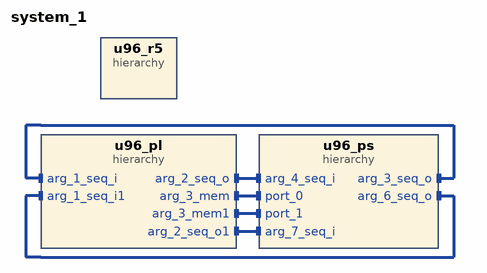
[diagram p0: block diagram of the top level]
# Vivado block design system_1, xczu3eg-sbva484-1-e, Vivado 2019.2
create_bd_design system_1

create_bd_cell -type hier u96_pl
create_bd_cell -type hier u96_ps
create_bd_cell -type hier u96_r5

# ---- hierarchy /u96_pl ----
current_bd_instance /u96_pl
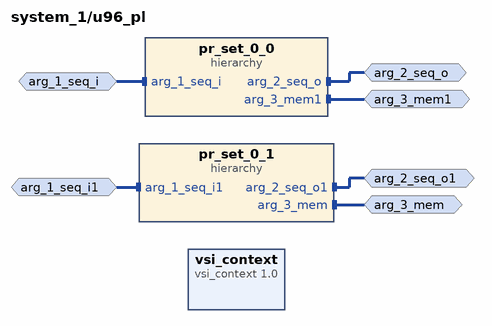
[diagram p1: block diagram inside /u96_pl]
create_bd_intf_pin -mode Master -vlnv xilinx.com:interface:aximm_rtl:1.0 arg_3_mem
create_bd_intf_pin -mode Master -vlnv xilinx.com:interface:aximm_rtl:1.0 arg_3_mem1
create_bd_intf_pin -mode Slave -vlnv xilinx.com:interface:axis_rtl:1.0 arg_1_seq_i
create_bd_intf_pin -mode Slave -vlnv xilinx.com:interface:axis_rtl:1.0 arg_1_seq_i1
create_bd_intf_pin -mode Master -vlnv xilinx.com:interface:axis_rtl:1.0 arg_2_seq_o
create_bd_intf_pin -mode Master -vlnv xilinx.com:interface:axis_rtl:1.0 arg_2_seq_o1

create_bd_cell -type ip -vlnv vsi.com:platform:vsi_context:1.0 vsi_context
set_property -dict [list \
  CONFIG.LOGO_FILE data/vsi_context_hardware_pr.png \
  CONFIG.OS Linux \
  CONFIG.build_output binary \
  CONFIG.c_compiler_options {-std=c11 -static -g -DDEBUG -O0} \
  CONFIG.cc_compiler_options {-std=c++11 -static -g -DDEBUG -O0 -fpermissive} \
  CONFIG.cc_prefix null \
  CONFIG.cpu_type 1 \
  CONFIG.current_platform ultra96_platform \
  CONFIG.default_fifo_size 65536 \
  CONFIG.fpga_board em.avnet.com:ultra96v1:part0:1.2 \
  CONFIG.fpga_part xczu3eg-sbva484-1-e \
  CONFIG.hostname localhost \
  CONFIG.impl_strategy default \
  CONFIG.include_directories {$(XFOPENCV)/include,} \
  CONFIG.ip_build_in false \
  CONFIG.is_cc false \
  CONFIG.is_main true \
  CONFIG.is_system_gui true \
  CONFIG.language hls \
  CONFIG.load_on_demand true \
  CONFIG.map_exposed api \
  CONFIG.map_port 1999 \
  CONFIG.no_dma false \
  CONFIG.num_cpus 1 \
  CONFIG.platform_power 0 \
  CONFIG.python_version 2 \
  CONFIG.reserve_crs 3 \
  CONFIG.rt_build_type 1 \
  CONFIG.simulator 1 \
  CONFIG.synthesis_mode 1 \
  CONFIG.target_platform standard \
  CONFIG.trace_divisor 8 \
  CONFIG.trace_frequency 50 \
  CONFIG.trace_poll_timer 100000 \
  CONFIG.type 2 \
  CONFIG.use_opencv false \
  CONFIG.use_v4l false \
  CONFIG.use_xdma false \
] [get_bd_cells vsi_context]
create_bd_cell -type hier pr_set_0_0
create_bd_cell -type hier pr_set_0_1

# ---- hierarchy /u96_pl/pr_set_0_0 ----
current_bd_instance /u96_pl/pr_set_0_0
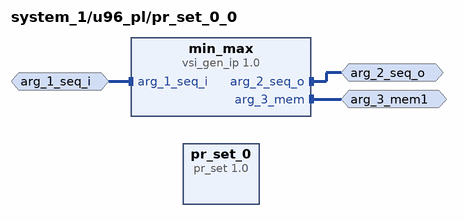
[diagram p2: block diagram inside /u96_pl/pr_set_0_0]
create_bd_intf_pin -mode Slave -vlnv xilinx.com:interface:axis_rtl:1.0 arg_1_seq_i
create_bd_intf_pin -mode Master -vlnv xilinx.com:interface:axis_rtl:1.0 arg_2_seq_o
create_bd_intf_pin -mode Master -vlnv xilinx.com:interface:aximm_rtl:1.0 arg_3_mem1

create_bd_cell -type ip -vlnv vsi.com:soft_ip:vsi_gen_ip:1.0 min_max
set_property -dict [list \
  CONFIG.C_FUNC_NAME {min_max_shmem {type CXX_SRC file {$(VSI_INSTALL)/target/common/hls_examples/image_algos/image_algos.cc} includes {strings.h math.h hls_stream.h vsi_device.h common/xf_common.h common/xf_utility.h core/xf_min_max_loc.hpp imgproc/xf_median_blur.hpp imgproc/xf_gaussian_filter.hpp imgproc/xf_mean_shift.hpp imgproc/xf_dilation.hpp imgproc/xf_erosion.hpp imgproc/xf_canny.hpp imgproc/xf_edge_tracing.hpp features/xf_fast.hpp ap_int.h image_algos.h math.h } ret void args {start {tname "hls::stream<st> &" tsize -2 ttype "LValueReference" tattr "data last"} done {tname "hls::stream<st> &" tsize -2 ttype "LValueReference" tattr "data last"} io_frame {tname "uint32_t [19200]" tsize 76800 ttype "ConstantArray" tattr ""} }}} \
  CONFIG.ENV_SOURCE_DIR {$(VSI_INSTALL)/target/common/hls_examples/image_algos,} \
  CONFIG.NUM_PARAMS 3 \
  CONFIG.P00_change_trigger true \
  CONFIG.P00_param_ctype {hls::stream<st> &} \
  CONFIG.P00_param_name start \
  CONFIG.P00_param_size -2 \
  CONFIG.P00_param_type 3 \
  CONFIG.P00_sideband {data last} \
  CONFIG.P01_param_ctype {hls::stream<st> &} \
  CONFIG.P01_param_dir 2 \
  CONFIG.P01_param_name done \
  CONFIG.P01_param_size -2 \
  CONFIG.P01_param_type 3 \
  CONFIG.P01_sideband {data last} \
  CONFIG.P02_param_access 3 \
  CONFIG.P02_param_ctype {uint32_t [19200]} \
  CONFIG.P02_param_dir 3 \
  CONFIG.P02_param_name io_frame \
  CONFIG.P02_param_size 76800 \
  CONFIG.P02_param_type 2 \
  CONFIG.P03_param_size 0 \
  CONFIG.P04_param_size 0 \
  CONFIG.P05_param_size 0 \
  CONFIG.P06_param_size 0 \
  CONFIG.P07_param_size 0 \
  CONFIG.P08_param_size 0 \
  CONFIG.P09_param_size 0 \
  CONFIG.P0A_param_size 0 \
  CONFIG.P0B_param_size 0 \
  CONFIG.P0C_param_size 0 \
  CONFIG.P0D_param_size 0 \
  CONFIG.P0E_param_size 0 \
  CONFIG.P0F_param_size 0 \
  CONFIG.SOURCE_DIR /home/dwq/Documents/Systemview/VSI/target/common/hls_examples/image_algos, \
] [get_bd_cells min_max]
create_bd_cell -type ip -vlnv vsi.com:context:pr_set:1.0 pr_set_0

# ---- hierarchy /u96_pl/pr_set_0_1 ----
current_bd_instance /u96_pl/pr_set_0_1
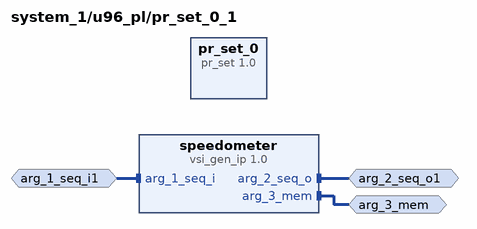
[diagram p3: block diagram inside /u96_pl/pr_set_0_1]
create_bd_intf_pin -mode Slave -vlnv xilinx.com:interface:axis_rtl:1.0 arg_1_seq_i1
create_bd_intf_pin -mode Master -vlnv xilinx.com:interface:aximm_rtl:1.0 arg_3_mem
create_bd_intf_pin -mode Master -vlnv xilinx.com:interface:axis_rtl:1.0 arg_2_seq_o1

create_bd_cell -type ip -vlnv vsi.com:soft_ip:vsi_gen_ip:1.0 speedometer
set_property -dict [list \
  CONFIG.C_FUNC_NAME {draw_speedometer {type CXX_SRC file {$(VSI_INSTALL)/target/common/hls_examples/image_algos/image_algos.cc} includes {strings.h math.h hls_stream.h vsi_device.h common/xf_common.h common/xf_utility.h core/xf_min_max_loc.hpp imgproc/xf_median_blur.hpp imgproc/xf_gaussian_filter.hpp imgproc/xf_mean_shift.hpp imgproc/xf_dilation.hpp imgproc/xf_erosion.hpp imgproc/xf_canny.hpp imgproc/xf_edge_tracing.hpp features/xf_fast.hpp ap_int.h image_algos.h math.h } ret void args {start {tname "hls::stream<st> &" tsize -2 ttype "LValueReference" tattr "data last"} done {tname "hls::stream<st> &" tsize -2 ttype "LValueReference" tattr "data last"} io_frame {tname "uint32_t [19200]" tsize 76800 ttype "ConstantArray" tattr ""} }}} \
  CONFIG.ENV_SOURCE_DIR {$(VSI_INSTALL)/target/common/hls_examples/image_algos,} \
  CONFIG.NUM_PARAMS 3 \
  CONFIG.P00_change_trigger true \
  CONFIG.P00_param_ctype {hls::stream<st> &} \
  CONFIG.P00_param_name start \
  CONFIG.P00_param_size -2 \
  CONFIG.P00_param_type 3 \
  CONFIG.P00_sideband {data last} \
  CONFIG.P01_param_ctype {hls::stream<st> &} \
  CONFIG.P01_param_dir 2 \
  CONFIG.P01_param_name done \
  CONFIG.P01_param_size -2 \
  CONFIG.P01_param_type 3 \
  CONFIG.P01_sideband {data last} \
  CONFIG.P02_param_access 3 \
  CONFIG.P02_param_ctype {uint32_t [19200]} \
  CONFIG.P02_param_dir 3 \
  CONFIG.P02_param_name io_frame \
  CONFIG.P02_param_size 76800 \
  CONFIG.P02_param_type 2 \
  CONFIG.P03_param_size 0 \
  CONFIG.P04_param_size 0 \
  CONFIG.P05_param_size 0 \
  CONFIG.P06_param_size 0 \
  CONFIG.P07_param_size 0 \
  CONFIG.P08_param_size 0 \
  CONFIG.P09_param_size 0 \
  CONFIG.P0A_param_size 0 \
  CONFIG.P0B_param_size 0 \
  CONFIG.P0C_param_size 0 \
  CONFIG.P0D_param_size 0 \
  CONFIG.P0E_param_size 0 \
  CONFIG.P0F_param_size 0 \
  CONFIG.SOURCE_DIR /home/dwq/Documents/Systemview/VSI/target/common/hls_examples/image_algos, \
] [get_bd_cells speedometer]
create_bd_cell -type ip -vlnv vsi.com:context:pr_set:1.0 pr_set_0
set_property -dict {CONFIG.lod_id 1} [get_bd_cells pr_set_0]

# ---- hierarchy /u96_ps ----
current_bd_instance /u96_ps
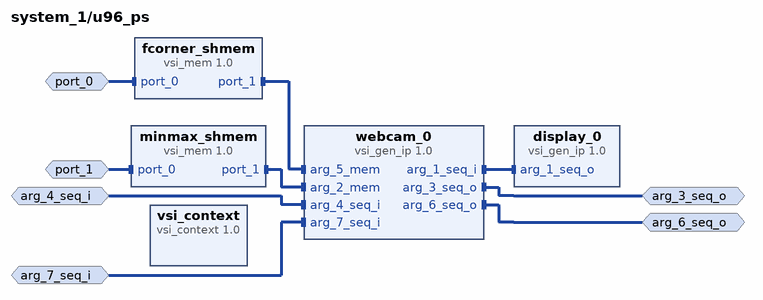
[diagram p4: block diagram inside /u96_ps]
create_bd_intf_pin -mode Slave -vlnv xilinx.com:interface:aximm_rtl:1.0 port_0
create_bd_intf_pin -mode Slave -vlnv xilinx.com:interface:aximm_rtl:1.0 port_1
create_bd_intf_pin -mode Master -vlnv xilinx.com:interface:axis_rtl:1.0 arg_3_seq_o
create_bd_intf_pin -mode Master -vlnv xilinx.com:interface:axis_rtl:1.0 arg_6_seq_o
create_bd_intf_pin -mode Slave -vlnv xilinx.com:interface:axis_rtl:1.0 arg_4_seq_i
create_bd_intf_pin -mode Slave -vlnv xilinx.com:interface:axis_rtl:1.0 arg_7_seq_i

create_bd_cell -type ip -vlnv vsi.com:platform:vsi_context:1.0 vsi_context
set_property -dict [list \
  CONFIG.LOGO_FILE data/vsi_context_cpp.png \
  CONFIG.OS Linux \
  CONFIG.build_output binary \
  CONFIG.c_compiler_options {-std=c11  -g   -DDEBUG -O0} \
  CONFIG.cc_compiler_options {-std=c++11 -g  -DDEBUG -O0 -fpermissive} \
  CONFIG.cc_prefix aarch64-linux-gnu- \
  CONFIG.cpu_type 3 \
  CONFIG.current_platform ultra96_platform \
  CONFIG.default_fifo_size 4096 \
  CONFIG.fpga_board null \
  CONFIG.fpga_part null \
  CONFIG.hostname localhost \
  CONFIG.impl_strategy default \
  CONFIG.include_directories {/home/dwq/Documents/Xilinx/Vivado/2019.2/include,$(SYSROOT)/../,} \
  CONFIG.ip_build_in false \
  CONFIG.is_cc true \
  CONFIG.is_main true \
  CONFIG.is_system_gui true \
  CONFIG.language hls \
  CONFIG.load_on_demand false \
  CONFIG.map_exposed api \
  CONFIG.map_port 1999 \
  CONFIG.no_dma false \
  CONFIG.num_cpus 1 \
  CONFIG.platform_power 0 \
  CONFIG.python_version 2 \
  CONFIG.reserve_crs 3 \
  CONFIG.rt_build_type 1 \
  CONFIG.simulator 1 \
  CONFIG.synthesis_mode 1 \
  CONFIG.sysroot {$(SYSROOT)} \
  CONFIG.target_platform standard \
  CONFIG.trace_divisor 8 \
  CONFIG.trace_frequency 50 \
  CONFIG.trace_poll_timer 100000 \
  CONFIG.type 1 \
  CONFIG.use_opencv true \
  CONFIG.use_v4l true \
  CONFIG.use_xdma false \
] [get_bd_cells vsi_context]
create_bd_cell -type ip -vlnv vsi.com:soft_ip:vsi_gen_ip:1.0 display_0
set_property -dict [list \
  CONFIG.C_FUNC_NAME {display_image {type CXX_SRC file {$(VSI_INSTALL)/target/common/hls_examples/webcam/webcam.cc} includes {webcam.h } ret void args {control {tname "hls::stream<int> &" tsize -2 ttype "LValueReference" tattr ""} }}} \
  CONFIG.ENV_SOURCE_DIR {$(VSI_INSTALL)/target/common/hls_examples/webcam,} \
  CONFIG.P00_param_ctype {hls::stream<int> &} \
  CONFIG.P00_param_dir 2 \
  CONFIG.P00_param_name control \
  CONFIG.P00_param_size -2 \
  CONFIG.P00_param_type 3 \
  CONFIG.P01_param_size 0 \
  CONFIG.P02_param_size 0 \
  CONFIG.P03_param_size 0 \
  CONFIG.P04_param_size 0 \
  CONFIG.P05_param_size 0 \
  CONFIG.P06_param_size 0 \
  CONFIG.P07_param_size 0 \
  CONFIG.P08_param_size 0 \
  CONFIG.P09_param_size 0 \
  CONFIG.P0A_param_size 0 \
  CONFIG.P0B_param_size 0 \
  CONFIG.P0C_param_size 0 \
  CONFIG.P0D_param_size 0 \
  CONFIG.P0E_param_size 0 \
  CONFIG.P0F_param_size 0 \
  CONFIG.SOURCE_DIR /home/dwq/Documents/Systemview/VSI/target/common/hls_examples/webcam, \
] [get_bd_cells display_0]
create_bd_cell -type ip -vlnv vsi.com:vsi_software_lib:vsi_mem:1.0 fcorner_shmem
set_property -dict {CONFIG.MEM_SIZE_KB 1024 CONFIG.num_ports 2 CONFIG.share_with_hw true} [get_bd_cells fcorner_shmem]
create_bd_cell -type ip -vlnv vsi.com:vsi_software_lib:vsi_mem:1.0 minmax_shmem
set_property -dict {CONFIG.MEM_SIZE_KB 1024 CONFIG.num_ports 2 CONFIG.share_with_hw true} [get_bd_cells minmax_shmem]
create_bd_cell -type ip -vlnv vsi.com:soft_ip:vsi_gen_ip:1.0 webcam_0
set_property -dict [list \
  CONFIG.C_FUNC_NAME {webcam0 {type CXX_SRC file {$(VSI_INSTALL)/target/common/hls_examples/webcam/webcam.cc} includes {webcam.h } ret void args {control {tname "hls::stream<int> &" tsize -2 ttype "LValueReference" tattr ""} mem_mm {tname "vsi::device &" tsize 8 ttype "LValueReference" tattr ""} start_mm {tname "hls::stream<st> &" tsize -2 ttype "LValueReference" tattr "data last"} done_mm {tname "hls::stream<st> &" tsize -2 ttype "LValueReference" tattr "data last"} mem_fc {tname "vsi::device &" tsize 8 ttype "LValueReference" tattr ""} start_fc {tname "hls::stream<st> &" tsize -2 ttype "LValueReference" tattr "data last"} done_fc {tname "hls::stream<st> &" tsize -2 ttype "LValueReference" tattr "data last"} }}} \
  CONFIG.ENV_SOURCE_DIR {$(VSI_INSTALL)/target/common/hls_examples/webcam,} \
  CONFIG.NUM_PARAMS 7 \
  CONFIG.P00_param_ctype {hls::stream<int> &} \
  CONFIG.P00_param_name control \
  CONFIG.P00_param_size -2 \
  CONFIG.P00_param_type 3 \
  CONFIG.P01_param_access 3 \
  CONFIG.P01_param_ctype {vsi::device &} \
  CONFIG.P01_param_dir 3 \
  CONFIG.P01_param_name mem_mm \
  CONFIG.P01_param_size 8 \
  CONFIG.P01_param_type 3 \
  CONFIG.P02_param_ctype {hls::stream<st> &} \
  CONFIG.P02_param_dir 2 \
  CONFIG.P02_param_name start_mm \
  CONFIG.P02_param_size -2 \
  CONFIG.P02_param_type 3 \
  CONFIG.P02_sideband {data last} \
  CONFIG.P03_param_ctype {hls::stream<st> &} \
  CONFIG.P03_param_name done_mm \
  CONFIG.P03_param_size -2 \
  CONFIG.P03_param_type 3 \
  CONFIG.P03_sideband {data last} \
  CONFIG.P04_param_access 3 \
  CONFIG.P04_param_ctype {vsi::device &} \
  CONFIG.P04_param_dir 3 \
  CONFIG.P04_param_name mem_fc \
  CONFIG.P04_param_size 8 \
  CONFIG.P04_param_type 3 \
  CONFIG.P05_param_ctype {hls::stream<st> &} \
  CONFIG.P05_param_dir 2 \
  CONFIG.P05_param_name start_fc \
  CONFIG.P05_param_size -2 \
  CONFIG.P05_param_type 3 \
  CONFIG.P05_sideband {data last} \
  CONFIG.P06_param_ctype {hls::stream<st> &} \
  CONFIG.P06_param_name done_fc \
  CONFIG.P06_param_size -2 \
  CONFIG.P06_param_type 3 \
  CONFIG.P06_sideband {data last} \
  CONFIG.P07_param_size 0 \
  CONFIG.P08_param_size 0 \
  CONFIG.P09_param_size 0 \
  CONFIG.P0A_param_size 0 \
  CONFIG.P0B_param_size 0 \
  CONFIG.P0C_param_size 0 \
  CONFIG.P0D_param_size 0 \
  CONFIG.P0E_param_size 0 \
  CONFIG.P0F_param_size 0 \
  CONFIG.SOURCE_DIR /home/dwq/Documents/Systemview/VSI/target/common/hls_examples/webcam, \
] [get_bd_cells webcam_0]

# ---- hierarchy /u96_r5 ----
current_bd_instance /u96_r5
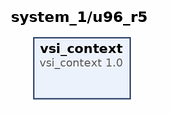
[diagram p5: block diagram inside /u96_r5]
create_bd_cell -type ip -vlnv vsi.com:platform:vsi_context:1.0 vsi_context
set_property -dict [list \
  CONFIG.LOGO_FILE data/vsi_context_cpp.png \
  CONFIG.OS FreeRTOS \
  CONFIG.build_output binary \
  CONFIG.c_compiler_options {-std=c11 -static -g -DDEBUG -O0} \
  CONFIG.cc_compiler_options {-std=c++11 -static -g -DDEBUG -O0 -fpermissive} \
  CONFIG.cc_prefix armr5-none-eabi- \
  CONFIG.cpu_type 4 \
  CONFIG.current_platform ultra96_platform \
  CONFIG.default_fifo_size 4096 \
  CONFIG.fpga_board null \
  CONFIG.fpga_part null \
  CONFIG.hostname localhost \
  CONFIG.impl_strategy default \
  CONFIG.ip_build_in false \
  CONFIG.is_cc true \
  CONFIG.is_main false \
  CONFIG.is_system_gui true \
  CONFIG.language hls \
  CONFIG.load_on_demand false \
  CONFIG.map_exposed api \
  CONFIG.map_port 1999 \
  CONFIG.no_dma false \
  CONFIG.num_cpus 1 \
  CONFIG.platform_power 0 \
  CONFIG.python_version 2 \
  CONFIG.reserve_crs 3 \
  CONFIG.rt_build_type 1 \
  CONFIG.simulator 1 \
  CONFIG.synthesis_mode 1 \
  CONFIG.target_platform standard \
  CONFIG.trace_divisor 8 \
  CONFIG.trace_frequency 50 \
  CONFIG.trace_poll_timer 100000 \
  CONFIG.type 1 \
  CONFIG.use_opencv false \
  CONFIG.use_v4l false \
  CONFIG.use_xdma false \
] [get_bd_cells vsi_context]

# ---- connections ----

current_bd_instance /u96_pl
connect_bd_intf_net [get_bd_intf_pins arg_2_seq_o] [get_bd_intf_pins pr_set_0_0/arg_2_seq_o]
connect_bd_intf_net -intf_net arg_1_seq_i1_1 [get_bd_intf_pins arg_1_seq_i1] [get_bd_intf_pins pr_set_0_1/arg_1_seq_i1]
connect_bd_intf_net [get_bd_intf_pins arg_3_mem] [get_bd_intf_pins pr_set_0_1/arg_3_mem]
connect_bd_intf_net [get_bd_intf_pins arg_1_seq_i] [get_bd_intf_pins pr_set_0_0/arg_1_seq_i]
connect_bd_intf_net [get_bd_intf_pins arg_2_seq_o1] [get_bd_intf_pins pr_set_0_1/arg_2_seq_o1]
connect_bd_intf_net [get_bd_intf_pins arg_3_mem1] [get_bd_intf_pins pr_set_0_0/arg_3_mem1]

current_bd_instance /u96_pl/pr_set_0_0
connect_bd_intf_net [get_bd_intf_pins arg_1_seq_i] [get_bd_intf_pins min_max/arg_1_seq_i]
connect_bd_intf_net [get_bd_intf_pins arg_2_seq_o] [get_bd_intf_pins min_max/arg_2_seq_o]
connect_bd_intf_net [get_bd_intf_pins arg_3_mem1] [get_bd_intf_pins min_max/arg_3_mem]

current_bd_instance /u96_pl/pr_set_0_1
connect_bd_intf_net [get_bd_intf_pins arg_3_mem] [get_bd_intf_pins speedometer/arg_3_mem]
connect_bd_intf_net [get_bd_intf_pins arg_1_seq_i1] [get_bd_intf_pins speedometer/arg_1_seq_i]
connect_bd_intf_net [get_bd_intf_pins arg_2_seq_o1] [get_bd_intf_pins speedometer/arg_2_seq_o]

current_bd_instance /u96_ps
connect_bd_intf_net -intf_net port_0_1 [get_bd_intf_pins port_0] [get_bd_intf_pins fcorner_shmem/port_0]
connect_bd_intf_net -intf_net vsi_gen_ip_1_arg_5_mem [get_bd_intf_pins fcorner_shmem/port_1] [get_bd_intf_pins webcam_0/arg_5_mem]
connect_bd_intf_net -intf_net vsi_gen_ip_1_arg_6_seq_o [get_bd_intf_pins arg_6_seq_o] [get_bd_intf_pins webcam_0/arg_6_seq_o]
connect_bd_intf_net [get_bd_intf_pins arg_4_seq_i] [get_bd_intf_pins webcam_0/arg_4_seq_i]
connect_bd_intf_net -intf_net port_1_1 [get_bd_intf_pins port_1] [get_bd_intf_pins minmax_shmem/port_0]
connect_bd_intf_net -intf_net vsi_gen_ip_1_arg_3_seq_o [get_bd_intf_pins arg_3_seq_o] [get_bd_intf_pins webcam_0/arg_3_seq_o]
connect_bd_intf_net -intf_net vsi_gen_ip_0_arg_1_seq_o [get_bd_intf_pins webcam_0/arg_1_seq_i] [get_bd_intf_pins display_0/arg_1_seq_o]
connect_bd_intf_net -intf_net vsi_gen_ip_1_arg_2_mem [get_bd_intf_pins minmax_shmem/port_1] [get_bd_intf_pins webcam_0/arg_2_mem]
connect_bd_intf_net [get_bd_intf_pins arg_7_seq_i] [get_bd_intf_pins webcam_0/arg_7_seq_i]

current_bd_instance /
connect_bd_intf_net [get_bd_intf_pins u96_ps/arg_4_seq_i] [get_bd_intf_pins u96_pl/arg_2_seq_o]
connect_bd_intf_net [get_bd_intf_pins u96_pl/arg_3_mem] [get_bd_intf_pins u96_ps/port_0]
connect_bd_intf_net [get_bd_intf_pins u96_pl/arg_3_mem1] [get_bd_intf_pins u96_ps/port_1]
connect_bd_intf_net [get_bd_intf_pins u96_pl/arg_1_seq_i] [get_bd_intf_pins u96_ps/arg_3_seq_o]
connect_bd_intf_net [get_bd_intf_pins u96_ps/arg_7_seq_i] [get_bd_intf_pins u96_pl/arg_2_seq_o1]
connect_bd_intf_net -intf_net arg_1_seq_i1_1 [get_bd_intf_pins u96_pl/arg_1_seq_i1] [get_bd_intf_pins u96_ps/arg_6_seq_o]

validate_bd_design
save_bd_design
